# Altium schematic sheet SH2 - CONNECTORS.SchDoc: Connectors
size B; CheckedBy: Lance Bantoto; Author: Aidan Gratton; DrawnBy: Aidan Gratton; Engineer: Aidan Gratton; Organization: UW Robotics; Address1: 200 University Avenue; Address2: Waterloo; Address3: Ontario; Address4: Canada N2L 3G6; Revision: 2; SheetNumber: 2; SheetTotal: 6
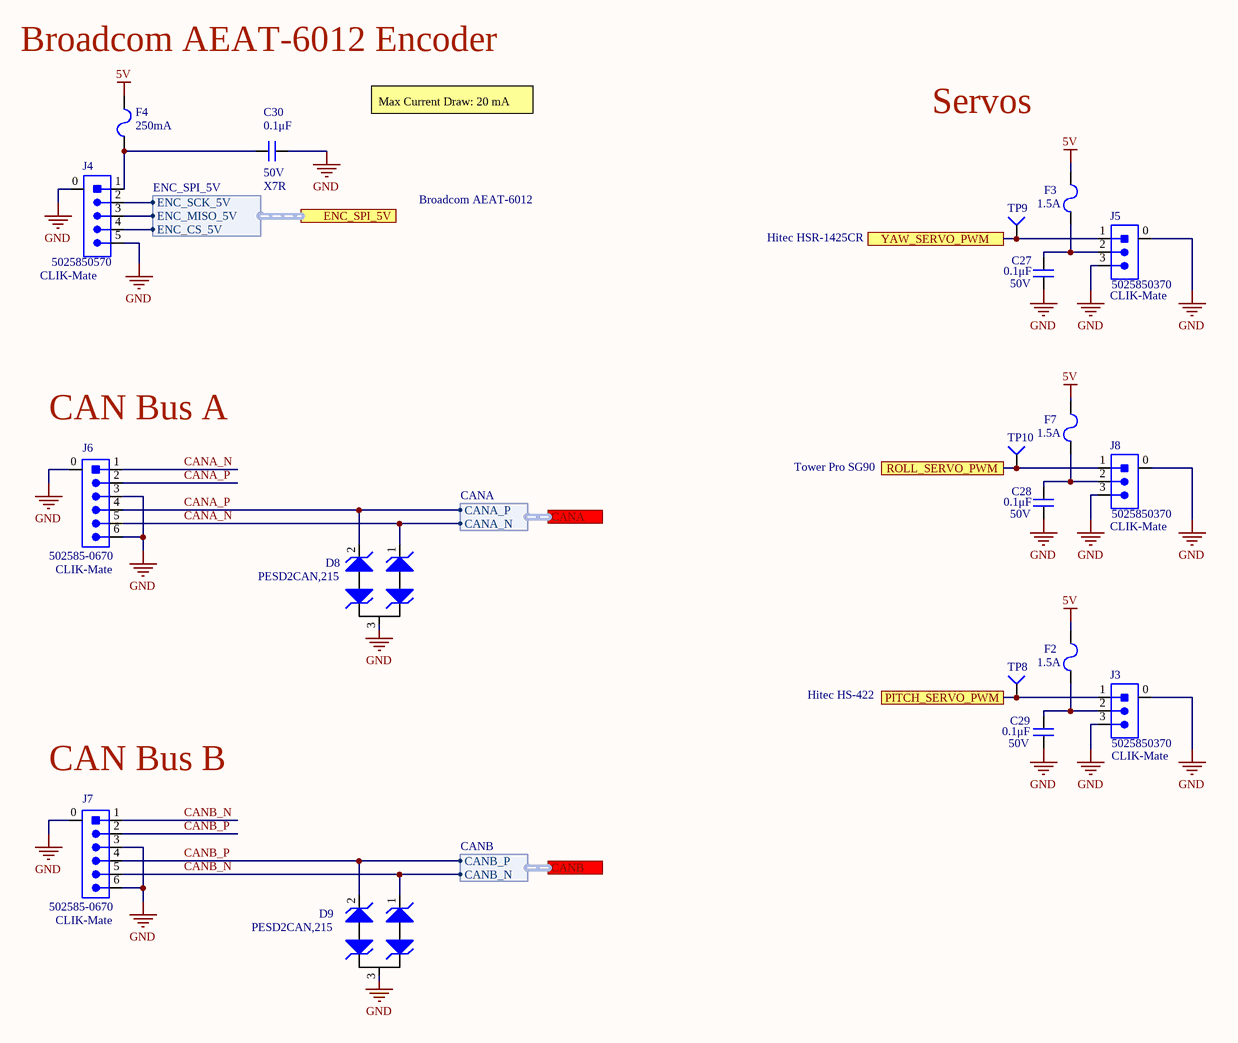
[diagram p0: SH2 - CONNECTORS.SchDoc]

## Parts
C27  value 0.1μF  Voltage Rating: 50V  [CAP0603]  (hidden comment: CAP_0.1uF_50V_0603)
C28  value 0.1μF  Voltage Rating: 50V  [CAP0603]  (hidden comment: CAP_0.1uF_50V_0603)
C29  value 0.1μF  Voltage Rating: 50V  [CAP0603]  (hidden comment: CAP_0.1uF_50V_0603)
C30  value 0.1μF  Dielectric: X7R  Voltage Rating: 50V  [CAP0603]  (hidden comment: CAP_0.1uF_50V_0603)
D8  Manufacturer Part Number 1: PESD2CAN,215  [TVS_DIODE_CAN]  (hidden comment: TVS_DIODE_CAN)
D9  Manufacturer Part Number 1: PESD2CAN,215  [TVS_DIODE_CAN]  (hidden comment: TVS_DIODE_CAN)
F2  Current Rating: 1.5A  [FUSE_1206]  (hidden comment: FUSE_1.5A_1206)
F3  Current Rating: 1.5A  [FUSE_1206]  (hidden comment: FUSE_1.5A_1206)
F4  Current Rating: 250mA  [FUSE_0603]  (hidden comment: FUSE_250mA_0603)
F7  Current Rating: 1.5A  [FUSE_1206]  (hidden comment: FUSE_1.5A_1206)
J3  Manufacturer Part Number 1: 5025850370  Family: CLIK-Mate  [MOLEX-5025850370]  (hidden comment: CON_3M_SM_RA)
J4  Manufacturer Part Number 1: 5025850570  Family: CLIK-Mate  [MOLEX-5025850570]  (hidden comment: CON_5M_SM_RA)
J5  Manufacturer Part Number 1: 5025850370  Family: CLIK-Mate  [MOLEX-5025850370]  (hidden comment: CON_3M_SM_RA)
J6  Family: CLIK-Mate  Manufactor Number: 502585-0670  [MOLEX-5025850670]  (hidden comment: CON_6M_SM_RA_1.5mm)
J7  Family: CLIK-Mate  Manufactor Number: 502585-0670  [MOLEX-5025850670]  (hidden comment: CON_6M_SM_RA_1.5mm)
J8  Manufacturer Part Number 1: 5025850370  Family: CLIK-Mate  [MOLEX-5025850370]  (hidden comment: CON_3M_SM_RA)
TP8  TESTPOINT_1MM_CIRCLE  [TESTPOINT_CIRCLE_1MM]  (value not drawn)  (no BOM)
TP9  TESTPOINT_1MM_CIRCLE  [TESTPOINT_CIRCLE_1MM]  (value not drawn)  (no BOM)
TP10  TESTPOINT_1MM_CIRCLE  [TESTPOINT_CIRCLE_1MM]  (value not drawn)  (no BOM)

## Ports
CANA (harness CANA), CANB (harness CANB), ENC_SPI_5V (harness ENC_SPI_5V), PITCH_SERVO_PWM, ROLL_SERVO_PWM, YAW_SERVO_PWM

## Harnesses
CANB: CANB_P, CANB_N
CANA: CANA_P, CANA_N
ENC_SPI_5V: ENC_MISO_5V, ENC_CS_5V, ENC_SCK_5V

## Nets
5V: F2.2 F3.2 F4.2 F7.2
GND: C27.1 C28.1 C29.1 C30.1 D8.3 D9.3 J3.0 J3.3 J4.0 J4.5 J5.0 J5.3 J6.0 J6.3 J6.6 J7.0 J7.3 J7.6 J8.0 J8.3
CANA_N: D8.1 J6.1 J6.5 ; port CANA.CANA_N
CANA_P: D8.2 J6.2 J6.4 ; port CANA.CANA_P
CANB_N: D9.1 J7.1 J7.5 ; port CANB.CANB_N
CANB_P: D9.2 J7.2 J7.4 ; port CANB.CANB_P
PITCH_SERVO_PWM: J3.1 TP8.1(=value) ; port PITCH_SERVO_PWM
ROLL_SERVO_PWM: J8.1 TP10.1(=value) ; port ROLL_SERVO_PWM
YAW_SERVO_PWM: J5.1 TP9.1(=value) ; port YAW_SERVO_PWM
NetC27_2: C27.2 F3.1 J5.2
NetC28_2: C28.2 F7.1 J8.2
NetC29_2: C29.2 F2.1 J3.2
NetC30_2: C30.2 F4.1 J4.1
NetJ4_2: J4.2 ; port ENC_SPI_5V.ENC_SCK_5V
NetJ4_3: J4.3 ; port ENC_SPI_5V.ENC_MISO_5V
NetJ4_4: J4.4 ; port ENC_SPI_5V.ENC_CS_5V

## Notes on the sheet
- (near F4) Broadcom AEAT-6012 Encoder
- Max Current Draw: 20 mA
- Servos
- Broadcom AEAT-6012
- Hitec HSR-1425CR
- (near J6) CAN Bus A
- Tower Pro SG90
- Hitec HS-422
- (near J7) CAN Bus B
- Title:
- Project:
- Date:
- Rev:
- Checker:
- Engineer:
- Sheet:
- of

## Library data of the parts
C27-C30 = CAP_0.1uF_50V_0603: CAP CER 0.1UF 50V X7R 0603; Manufacturer Part Number 1: CC0603KRX7R9BB104; Manufacturer 1: Yageo; Package/Footprint: 0603; Temperature Coefficient: X7R; Supplier Part Number 1: 311-1344-1-ND; Supplier 1: Digi-Key; Mounting Type: SMD
  C27-C29: Dielectric: X7R
D8 D9 = TVS_DIODE_CAN: TVS DIODE 24V 41V SOT323-3; Manufacturer 1: Nexperia USA Inc.; Supplier Part Number 1: 1727-3891-1-ND; Supplier 1: Digi-Key; Package/Footprint: SOT323-3; Mounting Type: Surface Mount
F2 F3 F7 = FUSE_1.5A_1206: FUSE SMD 1.5A 63V; Manufacturer 1: Littelfuse; Manufacturer Part Number 1: 046601.5NR; Fuse Type: Board Mount (Cartridge Style Excluded); DC Cold Resistance: 31mR; Power Dissipation: 157.5mW; Approvals: UL,CSA; Package/Footprint: 1206; Supplier 1: Digi-Key; Housing Material: Ceramic; Min Operating Temperature: -55°C; Max Operating Temperature: 90°C; Voltage Rating (AC): 63V; Voltage Rating (DC): 63V; Current: 1.5A; Length: 3.18mm; Height: 0.023inch; Width: 0.06inch; Depth: 1.52mm; Supplier Part Number 1: F1462CT-ND; Mounting Type: SMD
F4 = FUSE_250mA_0603: FUSE SMD 250mA 32V; Manufacturer 1: Littelfuse; Manufacturer Part Number 1: 0467.250NRHF; Response Time: Fast Blow; Package/Footprint: 0603; Voltage Rating (AC): 32V; Voltage Rating (DC): 32V; Supplier 1: Digi-Key; Supplier Packaging 1: Cut Tape; Supplier Part Number 1: F6020CT-ND; Mounting Type: SMD
J3 J5 J8 = CON_3M_SM_RA: CONN RCPT 3POS 0.059 TIN SMD R/A; Manufacturer 1: Molex; Number of Contacts: 3; Current Rating: 2A; Voltage Rating: 100V; Connector Type: Receptacle,Center Strip Contact; Gender: Female; Contact Resistance: 20mR; Pitch: 1.5mm; Glow Wire Compliant: Non-compliant; Supplier 1: Digi-Key; Category: Headers and Wire Housings; Stock 2: 133; Pricing 2: 1=0.53000, 10=0.50100, 100=0.38380, 500=0.33374 (USD); Contact Plating: Tin; Color: Beige; Housing Material: Thermoplastic; Contact Material: Copper Alloy; Min Operating Temperature: -40°C; Max Operating Temperature: 85°C; Number of Rows: 1; Termination: Solder; Orientation: Right Angle; Fastening Type: Latch; Number of Positions: 3; Number of Circuits: 3; Contact Gender: Female; Length: 8.8mm; Depth: 7.3mm; REACH SVHC: No SVHC; Supplier Part Number 1: WM12831CT-ND; Mounting Type: SMD; Package/Footprint: SMD
J4 = CON_5M_SM_RA: CONN HEADER SMD RIGHT ANGLE 1.5MM PITCH; Manufacturer 1: Molex; Connector Type: Receptacle,Center Strip Contact; Number of Positions: 5; Current Rating: 2A; Supplier 1: Digi-Key; Termination: Solder; Number of Contacts: 5; Orientation: Right Angle; Number of Circuits: 5; Number of Rows: 1; Supplier Part Number 1: WM14469CT-ND; Mounting Type: SMD; Package/Footprint: SMD
J6 J7 = CON_6M_SM_RA_1.5mm: CONN HEADER SMD RIGHT ANGLE 1.5 MM PITCH; Manufacturer: Molex; Supplier 1: Digi-Key; Supplier Part Number 1: WM12832CT-ND; Package/Footprint: SMD; Mounting Type: SMD
TP8-TP10 = TESTPOINT_1MM_CIRCLE: TESTPOINT 1MM CIRCLE; Part Number (MPN): *